# Altium schematic sheet TOFSensor.SchDoc
size A4
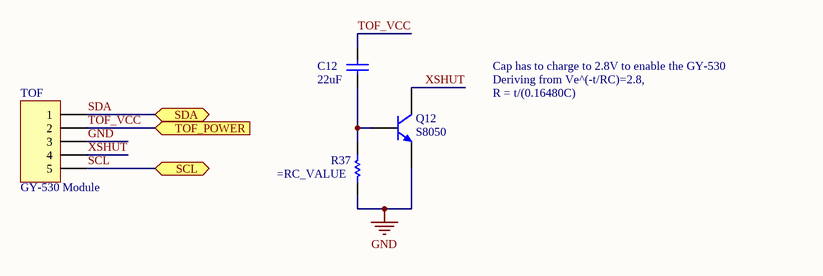
[diagram p0: TOFSensor.SchDoc]

## Parts
C12  value 22uF  [J1-0603]  (hidden comment: Cap)
Q12  S8050  [SOT23-3M]
R37  Res1  [J1-0603]  (value not drawn)
TOF  GY-530 Module  [HDR1X5]

## Ports
SCL (bidir), SDA (bidir), TOF_POWER (in)

## Nets
GND: Q12.2(E) R37.1 TOF.3
SCL: TOF.5 ; port SCL
SDA: TOF.1 ; port SDA
TOF_VCC: C12.1 TOF.2 ; port TOF_POWER
XSHUT: Q12.3(C) TOF.4
NetC12_2: C12.2 Q12.1(B) R37.2

## Notes on the sheet
- Cap has to charge to 2.8V to enable the GY-530
- Deriving from Ve^(-t/RC)=2.8,
- R = t/(0.16480C)

## Library data of the parts
C12 = Cap: Capacitor; Published: 8-Jun-2000; LatestRevisionDate: 17-Jul-2002; LatestRevisionNote: Re-released for DXP Platform.; PackageReference: RAD-0.3; Publisher: Altium Limited; PackageDescription: Radial Cap, Thru-Hole; 2 Leads; 0.3 in Pin Spacing; LCSC: C109447
Q12 = S8050: NPN General Purpose Amplifier; Published: 8-Jun-2000; LatestRevisionDate: 15-Jan-2003; LatestRevisionNote: PCB Footprint 'BCY-W3/D4.7' replaced; DatasheetVersion: 1997; PackageVersion: Sep-1998; PackageReference: TO-92A; Publisher: Altium Limited; PackageDescription: TO, Flat Index; 3 In-Line, Axial Leads; Body Dia. 4.5mm; Leads 0.51 x 0.48 mm (max); LCSC: C259988
R37 = Res1: Resistor; Published: 8-Jun-2000; LatestRevisionDate: 17-Jul-2002; LatestRevisionNote: Re-released for DXP Platform.; PackageReference: AXIAL-0.3; Publisher: Altium Limited; PackageDescription: Axial Device, Thru-Hole; 2 Leads; 0.3 in Pin Spacing; Value: =RC_VALUE
TOF = Header 5: Header, 5-Pin; LatestRevisionDate: 17-Jul-2002; LatestRevisionNote: Re-released for DXP Platform.; Publisher: Altium Limited